# Altium schematic sheet Toradex Carrier Board.SchDoc: Ixora
size A3; Organization: Toradex AG; Address1: Altsagenstrasse 5; Address2: Horw; Address3: 6048; Address4: Switzerland; DocumentNumber: 2; Revision: V1.1; SheetNumber: 17; SheetTotal: 17; PageSetup: Record=PageOptions|CenterHorizontal=True|CenterVertical=True|PrintScale=0.71|XCorrection=1.00|YCorrection=1.00|PrintKind=0|BorderSize=5000000|LeftOffset=0|BottomOffset=0|Orientation=2|PaperLength=1000|PaperWidth=1000|Scale=100|PaperSource=7|PrintQuality=600|MediaType=1|DitherType=10|PaperKind=A4|PrintScaleMode=1
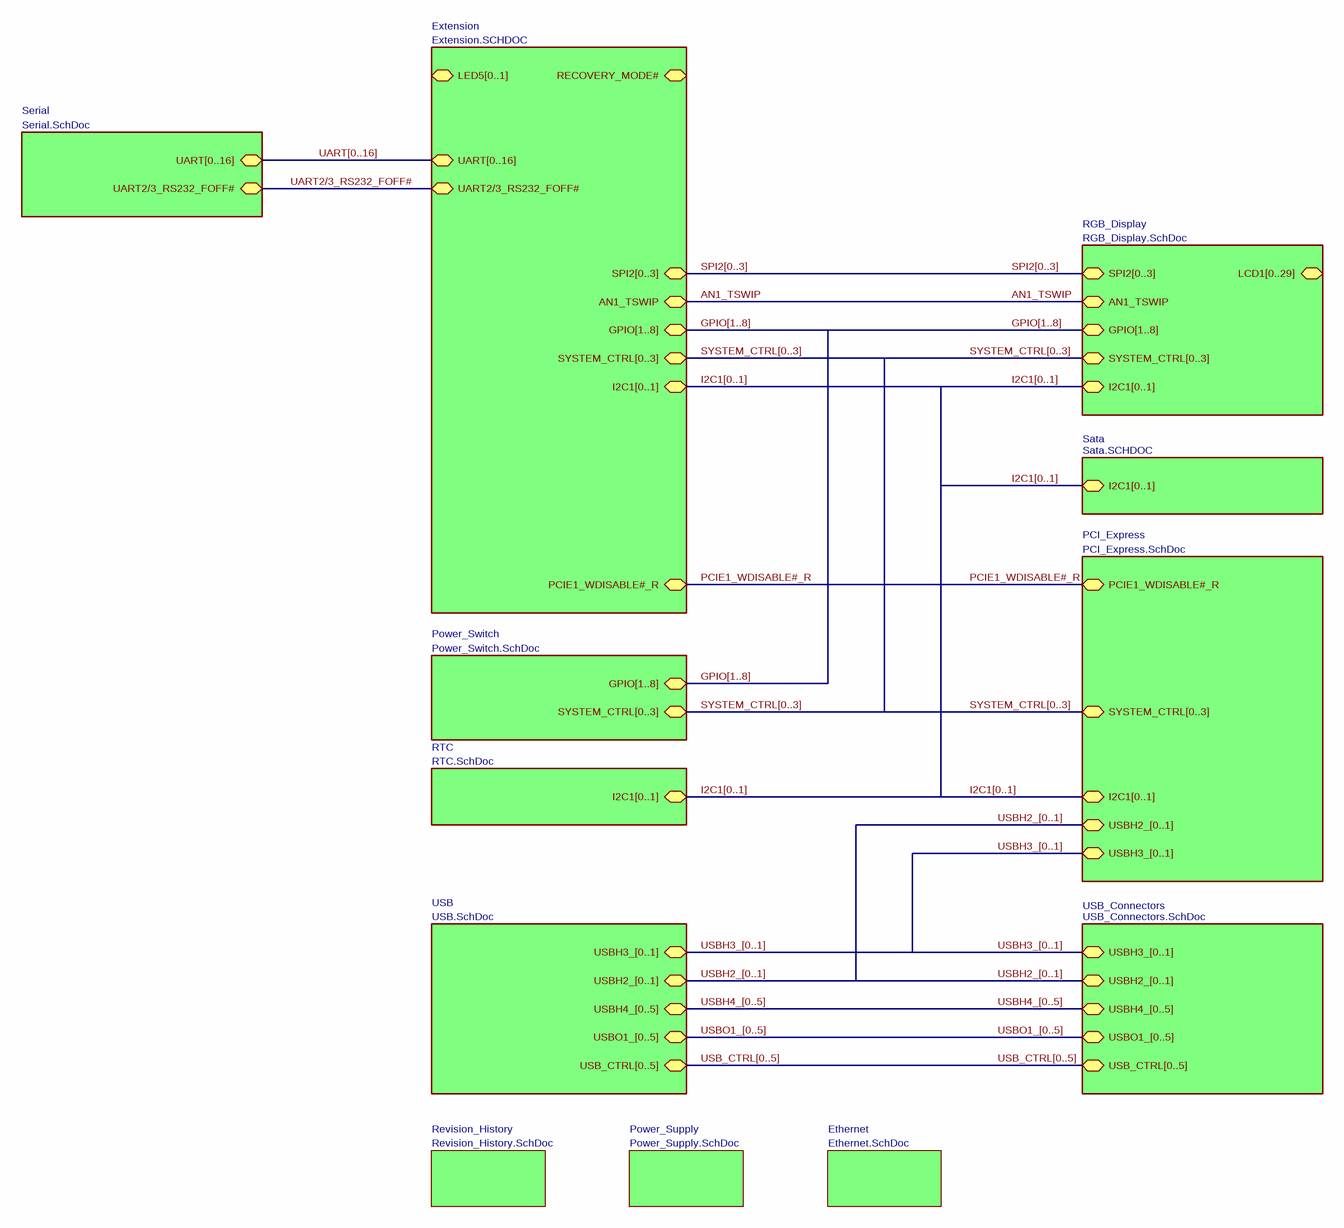
[diagram p0: Toradex Carrier Board.SchDoc]

## Sub-sheets
Ethernet = Ethernet.SchDoc: no entries
Extension = Extension.SCHDOC: AN1_TSWIP (bidir), GPIO[1..8] (bidir), UART[0..16] (bidir), I2C1[0..1] (bidir), SYSTEM_CTRL[0..3] (bidir), RECOVERY_MODE# (bidir), UART2/3_RS232_FOFF# (bidir), PCIE1_WDISABLE#_R (bidir), LED5[0..1] (bidir), SPI2[0..3] (bidir)
PCI_Express = PCI_Express.SchDoc: I2C1[0..1] (bidir), USBH2_[0..1] (bidir), SYSTEM_CTRL[0..3] (bidir), PCIE1_WDISABLE#_R (bidir), USBH3_[0..1] (bidir)
Power_Supply = Power_Supply.SchDoc: no entries
Power_Switch = Power_Switch.SchDoc: SYSTEM_CTRL[0..3] (bidir), GPIO[1..8] (bidir)
Revision_History = Revision_History.SchDoc: no entries
RGB_Display = RGB_Display.SchDoc: LCD1[0..29] (bidir), AN1_TSWIP (bidir), SYSTEM_CTRL[0..3] (bidir), GPIO[1..8] (bidir), SPI2[0..3] (bidir), I2C1[0..1] (bidir)
RTC = RTC.SchDoc: I2C1[0..1] (bidir)
Sata = Sata.SCHDOC: I2C1[0..1] (bidir)
Serial = Serial.SchDoc: UART[0..16] (bidir), UART2/3_RS232_FOFF# (bidir)
USB = USB.SchDoc: USBH2_[0..1] (bidir), USBO1_[0..5] (bidir), USBH4_[0..5] (bidir), USBH3_[0..1] (bidir), USB_CTRL[0..5] (bidir)
USB_Connectors = USB_Connectors.SchDoc: USBO1_[0..5] (bidir), USBH4_[0..5] (bidir), USBH3_[0..1] (bidir), USB_CTRL[0..5] (bidir), USBH2_[0..1] (bidir)

## Nets
AN1_TSWIP: sheet RGB_Display/AN1_TSWIP, sheet Extension/AN1_TSWIP
PCIE1_WDISABLE#_R: sheet PCI_Express/PCIE1_WDISABLE#_R, sheet Extension/PCIE1_WDISABLE#_R
UART2/3_RS232_FOFF#: sheet Serial/UART2/3_RS232_FOFF#, sheet Extension/UART2/3_RS232_FOFF#

## Buses and harness runs
bus GPIO[1..8] = sheet Extension/GPIO[1..8] = sheet Power_Switch/GPIO[1..8] = sheet RGB_Display/GPIO[1..8]
bus I2C1[0..1] = sheet Extension/I2C1[0..1] = sheet PCI_Express/I2C1[0..1] = sheet RGB_Display/I2C1[0..1] = sheet RTC/I2C1[0..1] = sheet Sata/I2C1[0..1]
bus SPI2[0..3] = sheet Extension/SPI2[0..3] = sheet RGB_Display/SPI2[0..3]
bus SYSTEM_CTRL[0..3] = sheet Extension/SYSTEM_CTRL[0..3] = sheet PCI_Express/SYSTEM_CTRL[0..3] = sheet Power_Switch/SYSTEM_CTRL[0..3] = sheet RGB_Display/SYSTEM_CTRL[0..3]
bus UART[0..16] = sheet Extension/UART[0..16] = sheet Serial/UART[0..16]
bus USB_CTRL[0..5] = sheet USB/USB_CTRL[0..5] = sheet USB_Connectors/USB_CTRL[0..5]
bus USBH2_[0..1] = sheet PCI_Express/USBH2_[0..1] = sheet USB/USBH2_[0..1] = sheet USB_Connectors/USBH2_[0..1]
bus USBH3_[0..1] = sheet PCI_Express/USBH3_[0..1] = sheet USB/USBH3_[0..1] = sheet USB_Connectors/USBH3_[0..1]
bus USBH4_[0..5] = sheet USB/USBH4_[0..5] = sheet USB_Connectors/USBH4_[0..5]
bus USBO1_[0..5] = sheet USB/USBO1_[0..5] = sheet USB_Connectors/USBO1_[0..5]

## Notes on the sheet
- Title
- Size:
- Date:
- A3
- Number:
- Time:
- Revision:
- Sheet
- of
- File: